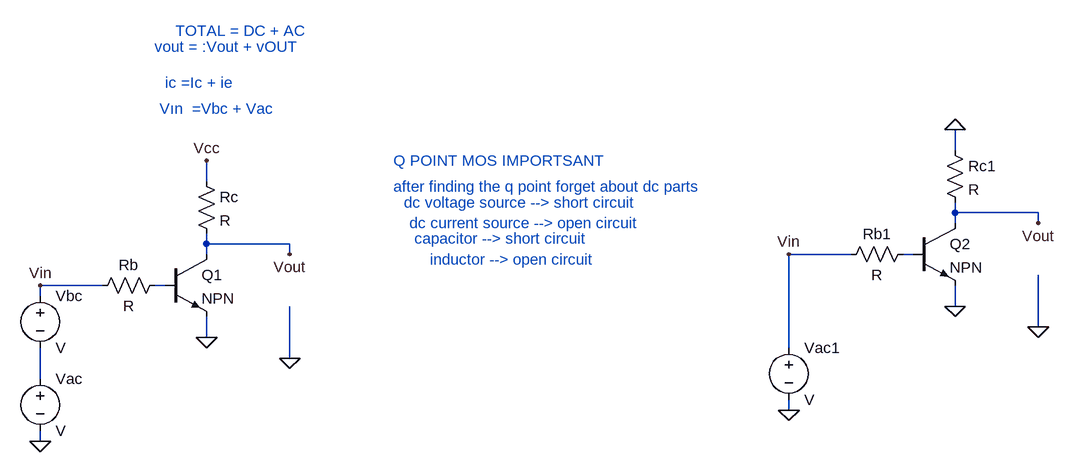
[diagram p0: schematic Draft59.asc]
Draft59.asc, the LTspice schematic file:
Version 4
SHEET 1 1480 680
WIRE 1280 -112 1280 -144
WIRE 128 -64 128 -96
WIRE 1280 -16 1280 -32
WIRE 1408 -16 1280 -16
WIRE 1280 0 1280 -16
WIRE 1408 0 1408 -16
WIRE 128 32 128 16
WIRE 256 32 128 32
WIRE 128 48 128 32
WIRE 256 48 256 32
WIRE 1120 48 1024 48
WIRE 1216 48 1200 48
WIRE -32 96 -128 96
WIRE 64 96 48 96
WIRE -128 112 -128 96
WIRE 1280 128 1280 96
WIRE 1408 160 1408 80
WIRE 128 176 128 144
WIRE 1024 192 1024 48
WIRE 256 208 256 128
WIRE -128 240 -128 192
WIRE 1024 288 1024 272
WIRE -128 336 -128 320
FLAG 256 208 0
FLAG 128 -96 Vcc
FLAG -128 96 Vin
FLAG 256 48 Vout
FLAG 128 176 0
FLAG -128 336 0
FLAG 1408 160 0
FLAG 1024 48 Vin
FLAG 1408 0 Vout
FLAG 1280 128 0
FLAG 1024 288 0
FLAG 1280 -144 0
SYMBOL npn 64 48 R0
SYMATTR InstName Q1
SYMBOL res 112 -80 R0
SYMATTR InstName Rc
SYMBOL res 64 80 R90
WINDOW 0 0 56 VBottom 2
WINDOW 3 32 56 VTop 2
SYMATTR InstName Rb
SYMBOL voltage -128 96 R0
SYMATTR InstName Vbc
SYMBOL voltage -128 224 R0
SYMATTR InstName Vac
SYMBOL npn 1216 0 R0
SYMATTR InstName Q2
SYMBOL res 1264 -128 R0
SYMATTR InstName Rc1
SYMBOL res 1216 32 R90
WINDOW 0 0 56 VBottom 2
WINDOW 3 32 56 VTop 2
SYMATTR InstName Rb1
SYMBOL voltage 1024 176 R0
SYMATTR InstName Vac1
TEXT 56 -176 Left 2 ;Vın  =Vbc + Vac
TEXT 64 -216 Left 2 ;ic =Ic + ie
TEXT 48 -272 Left 2 ;vout = :Vout + vOUT
TEXT 80 -296 Left 2 ;TOTAL = DC + AC
TEXT 416 -96 Left 2 ;Q POINT MOS IMPORTSANT
TEXT 416 -56 Left 2 ;after finding the q point forget about dc parts
TEXT 432 -32 Left 2 ;dc voltage source --> short circuit
TEXT 440 0 Left 2 ;dc current source --> open circuit
TEXT 448 24 Left 2 ;capacitor --> short circuit
TEXT 472 56 Left 2 ;inductor --> open circuit

The netlist it stands for:
* Draft59.asc
Q1 Vout N002 0 0 NPN
Rc Vcc Vout R
Rb N002 Vin R
Vbc Vin N003 V
Vac N003 0 V
Q2 Vout N001 0 0 NPN
Rc1 0 Vout R
Rb1 N001 Vin R
Vac1 Vin 0 V
.model NPN NPN
.model PNP PNP
.lib standard.bjt
* Vın  =Vbc + Vac
* ic =Ic + ie
* vout = :Vout + vOUT
* TOTAL = DC + AC
* Q POINT MOS IMPORTSANT
* after finding the q point forget about dc parts
* dc voltage source --> short circuit
* dc current source --> open circuit
* capacitor --> short circuit
* inductor --> open circuit
.backanno
.end